# Altium schematic sheet Trigger.SchDoc
size A4; SheetNumber: 1; SheetTotal: 1
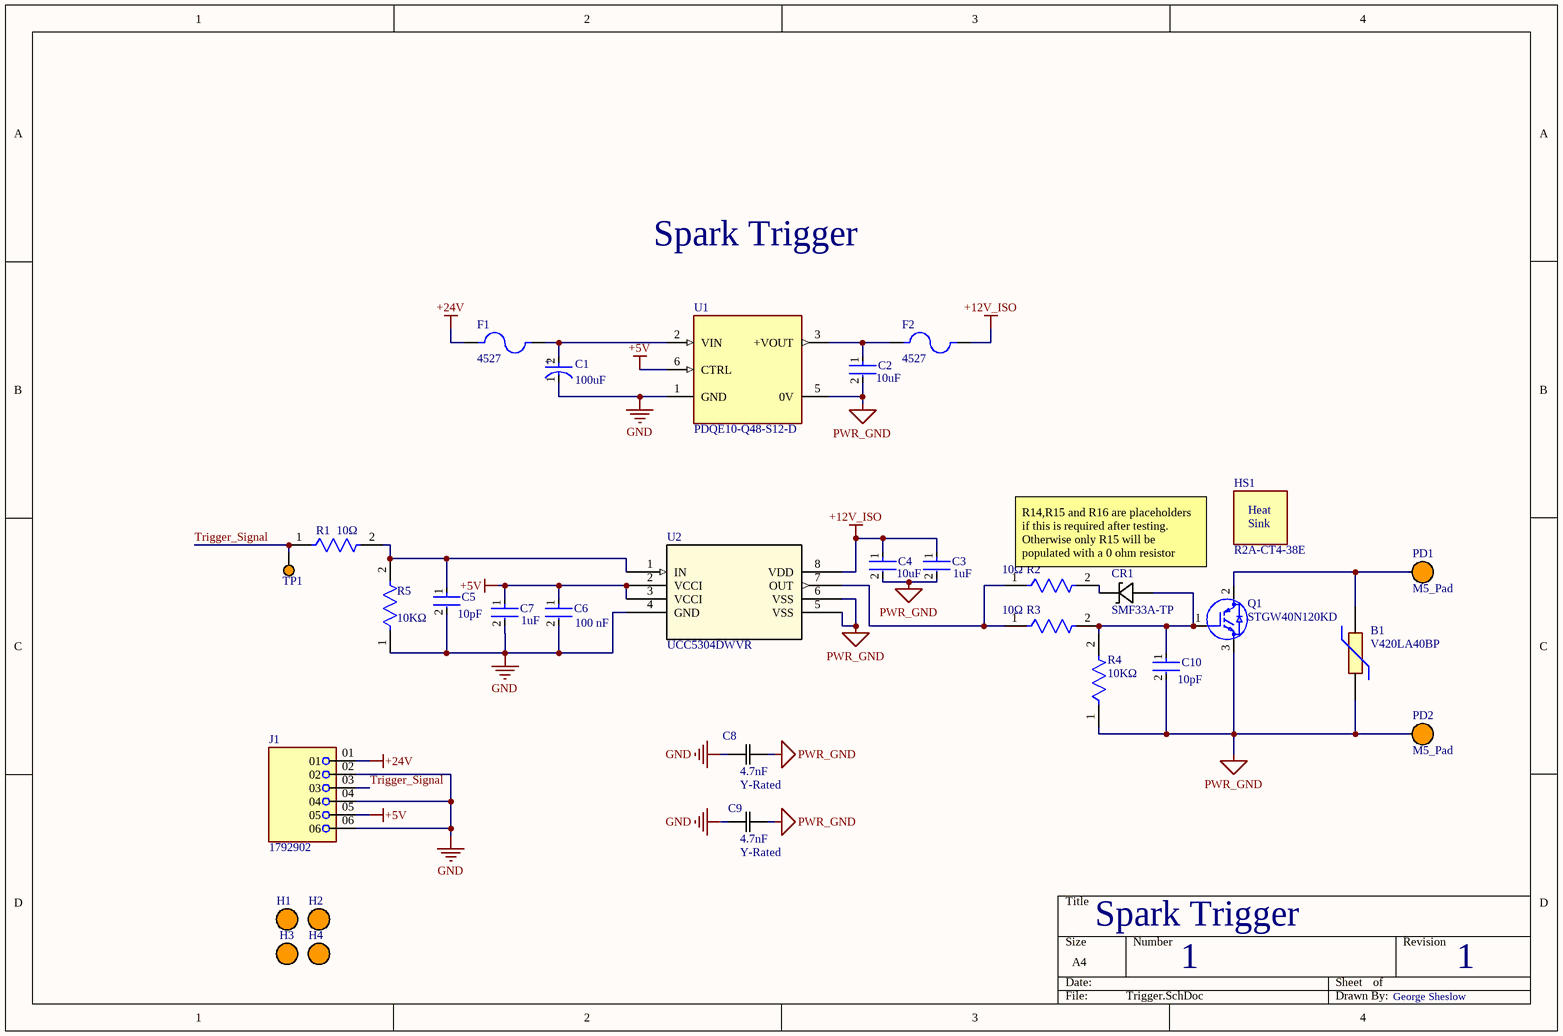
[diagram p0: Trigger.SchDoc]

## Parts
B1  V420LA40BP  [V420LA40BP]
C1  Capacitance: 100uF  [FP-RAD-TH-D_8_0_5-L_11_5-MFG]  (hidden comment: EEUFM1H101)
C2  Capacitance: 10uF  [FP-CL32-IPC_C]  (hidden comment: CL32B106KBJNNNE)
C3  value 1uF  [FP-CC1210-GA-MFG]  (hidden comment: CC1210KKX7R9BB105)
C4  Capacitance: 10uF  [FP-CL32-IPC_C]  (hidden comment: CL32B106KBJNNNE)
C5  Capacitance: 10pF  [FP-0805-L_2_01_0_2-W_1_25-MFG]  (hidden comment: 08051A100JAT2A)
C6  Capacitance: 100 nF  [FP-CC0805-0_85-MFG]  (hidden comment: CC0805KRX7R9BB104)
C7  value 1uF  [FP-CC1210-GA-MFG]  (hidden comment: CC1210KKX7R9BB105)
C8  capacitance: 4.7nF  rating: Y-Rated  [CAP_5.0 X 11.0 X 13.0_EPC]  (hidden comment: B32021A3472M189)
C9  capacitance: 4.7nF  rating: Y-Rated  [CAP_5.0 X 11.0 X 13.0_EPC]  (hidden comment: B32021A3472M189)
C10  Capacitance: 10pF  [FP-0805-L_2_01_0_2-W_1_25-MFG]  (hidden comment: 08051A100JAT2A)
CR1  SMF33A-TP  [SOD-123FL_MCC]
F1  4527  [FUSE_4527]
F2  4527  [FUSE_4527]
H1  M3_Hole  [M3_Hole]  (value not drawn)
H2  M3_Hole  [M3_Hole]  (value not drawn)
H3  M3_Hole  [M3_Hole]  (value not drawn)
H4  M3_Hole  [M3_Hole]  (value not drawn)
HS1  R2A-CT4-38E  [Heat_Sink]
J1  1792902  [PHOENIX_1792902]
PD1  M5_Pad  [M5_Pad]
PD2  M5_Pad  [M5_Pad]
Q1  STGW40N120KD  [TO545P515X1560X2445-3P]
R1  value 10Ω  [FP-RT0805-MFG]  (hidden comment: RT0805FRE0710RL)
R2  value 10Ω  [FP-RT0805-MFG]  (hidden comment: RT0805FRE0710RL)
R3  value 10Ω  [FP-RT0805-MFG]  (hidden comment: RT0805FRE0710RL)
R4  value 10KΩ  [FP-RT0805-MFG]  (hidden comment: RT0805FRE0710KL)
R5  value 10KΩ  [FP-RT0805-MFG]  (hidden comment: RT0805FRE0710KL)
TP1  Test Point  [Test_Pad]  (value not drawn)
U1  PDQE10-Q48-S12-D  [CONV_PDQE10-Q48-S12-D]
U2  UCC5304DWVR  [SOIC8_DWV_TEX]

## Nets
+5V: C6.1 C7.1 J1.05 U1.6(CTRL) U2.2(VCCI) U2.3(VCCI)
+12V_ISO: C3.1 C4.1 F2.2 U2.8(VDD)
+24V: F1.1 J1.01
GND: C1.1(C) C5.2 C6.2 C7.2 C8.1 C9.1 J1.02 J1.04 J1.06 R5.1 U1.1(GND) U2.4(GND)
PWR_GND: B1.1 C2.2 C3.2 C4.2 C8.2 C9.2 C10.2 PD2.1 Q1.3(E) R4.1 U1.5(0V) U2.5(VSS) U2.6(VSS)
Trigger_Signal: J1.03 R1.1 TP1.1(T)
NetB1_2: B1.2 PD1.1 Q1.2(C)
NetC1_2: C1.2(A) F1.2 U1.2(VIN)
NetC2_1: C2.1 F2.1 U1.3(+VOUT)
NetC5_1: C5.1 R1.2 R5.2 U2.1(IN)
NetC10_1: C10.1 CR1.2 Q1.1(G) R3.2 R4.2
NetCR1_1: CR1.1 R2.2
NetR2_1: R2.1 R3.1 U2.7(OUT)

## Notes on the sheet
- Spark Trigger
- R14,R15 and R16 are placeholders if this is required after testing.
  Otherwise only R15 will be populated with a 0 ohm resistor
- 1
- George Sheslow
- (in symbol CMP-05427-001978-1) +
- (in symbol R2A-CT4-38E) Heat; Sink

## Library data of the parts
B1 = V420LA40BP: Littelfuse LA Series Variable Resistor 600pF 100A, Clamping 1060V, Varistor 610  720V; Geometry.Height: 28mm; Mouser Part Number: 576-V420LA40BP; Mouser Price/Stock: https://www.mouser.co.uk/ProductDetail/Littelfuse/V420LA40BP?qs=%252BvNVc1OwqXLcs1GzcX8aHQ%3D%3D; Manufacturer_Name: LITTELFUSE; Manufacturer_Part_Number: V420LA40BP; Datasheet Link: https://www.littelfuse.com/~/media/electronics/datasheets/varistors/littelfuse_varistor_la_datasheet.pdf.pdf
C1 = CMP-05427-001978-1: Aluminum Electrolytic Capacitors (Radial Lead Type) 100uF ±20% 50V
C2 C4 = CMP-2000-06110-2: Cap Ceramic 10uF 50V X7R ±10% SMD 1210 +125°C Embossed T/R; Material: Ceramic; Min Operating Temperature: -55°C; Depth: 2.5mm; Radiation Hardening: No; Packaging: Tape and Reel; Dielectric: X7R; Case Code (Metric): 3225; Height: 2.5mm; Thickness: 0.106inch; Voltage Rating (DC): 50V; Voltage Rating: 50V; Width: 0.098inch; Case Code (Imperial): 1210; Length: 3.2mm; Tolerance: 10%; Lead Free: Lead Free; Package Quantity: 1; Voltage: 50V; Mount: Surface Mount; Case/Package: 1210; Max Operating Temperature: 125°C
C3 C7 = CMP-03422-000918-1: CAP CER 1UF 50V X7R 1210; Manufacturer: Yageo; Temperature Coefficient: 15%; Material: Ceramic; Tolerance: 10%; Manufacturer Part Number: CC1210KKX7R9BB105; RoHS: TRUE; Digikey Description: CAP CER 1UF 50V X7R 1210; Device Class L1: Passive Components; Temperature Range Low: -55°C; ComponentLink2Description: Datasheet; Temperature Characteristic: X7R; Capacitance: 1uF; Temperature: -55°C to +125°C; ComponentLink2URL: http://www.yageo.com/documents/recent/UPY-GPHC_X7R_6.3V-to-50V_18.pdf; Lead Free: Yes; Device Class L3: Ceramic Capacitors; Device Class L2: Capacitors; Category: Cap; Temperature Range High: +125°C; Package: CC1210-GA; Mouser Description: 1210 1 uF 50 V ±10 % Tolerance X7R SMT Multilayer Ceramic Capacitor; Octopart: https://octopart.com/cc1210kkx7r9bb105-yageo-22054290; Height: 1.45mm; Voltage Rating: 50V; Ipc Land Pattern Name: CAPC320250X125; Automotive: No; Footprint Url: http://www.yageo.com/exep/pages/download/literatures/UPY-C_GEN_24.pdf
C5 C10 = CMP-2007-04116-2: General Purpose Ceramic Capacitor, 0805, 10pF, 5%, C0G, 30ppm/°C, 100V; Dissipation Factor: 1.9%; Insulation Resistance: 100GR; Height: 0.94mm; Dielectric: C0G; Voltage Rating: 100V; REACH SVHC: No SVHC; Package Quantity: 1; Temperature Coefficient: 30ppm/°C; Mount: Surface Mount; Weight: 0.000194oz; Termination: SMD/SMT; Length: 2.01mm; Voltage: 100V; Case/Package: 0805; Width: 1.25mm; Case Code (Imperial): 0805; Case Code (Metric): 2012; Number of Pins: 2; Lead Free: Lead Free; Series: -; Min Operating Temperature: -55°C; Thickness: 0.037inch; Depth: 1.25mm; Max Operating Temperature: 125°C; Radiation Hardening: No; RoHS Compliant: Yes; Tolerance: 5%; Packaging: Tape and Reel; Voltage Rating (DC): 100V
C6 = CMP-2100-03606-3: CAP CER 0.1UF 50V X7R 0805; Manufacturer: Yageo; Tolerance: 0.1; Value: 100 nF; Material: Ceramic; Device Class L1: Passive Components; ComponentLink2Description: Datasheet; Package: CC0805-0.85; Manufacturer Part Number: CC0805KRX7R9BB104; Digikey Description: CAP CER 0.1UF 50V X7R 0805; Device Class L3: Ceramic Capacitors; Temperature: -30°C to +85°C; Temperature Characteristic: X7R; Voltage Rating: 50 V; Height: 0.95mm; RoHS: TRUE; Ipc Land Pattern Name: CAPC200125X85; Device Class L2: Capacitors; Category: Cap; Temperature Range Low: -30°C; Temperature Range High: +85°C; Mouser Description: Multilayer Ceramic Capacitors MLCC - SMD/SMT 100nF 50V X7R 10%; Footprint Url: http://www.yageo.com/exep/pages/download/literatures/UPY-C_GEN_24.pdf; Automotive: No; Octopart: https://octopart.com/cc0805krx7r9bb104-yageo-192993; Lead Free: Yes; ComponentLink2URL: http://www.yageo.com/documents/recent/UPY-GPHC_Y5V_6.3V-to-50V_8.pdf
C8 C9 = B32021A3472M189: No Description Available; Manufacturer_Name: TDK Epcos; Copyright: Copyright (C) 2025 Ultra Librarian. All rights reserved.; Manufacturer_Part_Number: B32021A3472M189
CR1 = SMF33A-TP: No Description Available; Manufacturer_Name: MCC; Copyright: Copyright (C) 2025 Ultra Librarian. All rights reserved.; Manufacturer_Part_Number: SMF33A-TP
F1 F2 = 4527: 5mm Low Profile Holder; MF: Keystone; MP: 4527; Price: None; Purchase-URL: https://pricing.snapeda.com/search/part/4527/?ref=eda; Package: None; Availability: In Stock; SnapEDA_Link: https://www.snapeda.com/parts/4527/Keystone+Electronics/view-part/?ref=snap; Value: *; Check_prices: https://www.snapeda.com/parts/4527/Keystone+Electronics/view-part/?ref=eda
HS1 = R2A-CT4-38E: Heatsink, TO-247, 8.6degC/W, 35.2 x 22 x 38mm, Spring Clip Mount | Ohmite R2A-CT4-38E; Shape: Fins,Rectangular; Finish: Anodized; Thermal Resistance @ Forced Air Flow (100 LFM): 1°C/W; Natural Thermal Resistance: 8.6°C/W; Supplier: Digikey; Supplier Part Number: R2A-CT4-38E-ND; Manufacturer: Ohmite; Manufacturer Part Number: R2A-CT4-38E; RoHS: Yes; Category: Heat Sinks; Stock: 8364; Pricing: 1=4.51, 10=3.996, 25=3.8064, 50=3.669, 100=3.5363, 480=3.25325, 960=3.13527, 1440=3.06819 (USD); Mounting Technology: Clip,PC Pin,Screw; Case/Package: TO-247; Weight: 6.4oz; Package Cooled: TO-247; Material: Aluminium; Color: Black; Package Quantity: 5; Type: Passive; Series: R2; Length: 38mm; Width: 35.2mm; Height: 22mm; Lead Free: Lead Free; RoHS Compliant: Yes; Reach SVHC Compliant: Unknown; ComponentLink1URL: https://datasheet.ciiva.com/1004/r2-series-1004312.pdf?src-supplier=Digikey; ComponentLink1Description: https://datasheet.ciiva.com/1004/r2-series-1004312.pdf?src-supplier=Digikey; ComponentLink2URL: https://datasheet.ciiva.com/39123/52r2-sink-39123818.pdf?src-supplier=Onlinecomponents.com; ComponentLink2Description: https://datasheet.ciiva.com/39123/52r2-sink-39123818.pdf?src-supplier=Onlinecomponents.com; ComponentLink3URL: https://datasheet.ciiva.com/14543/70231642-14543768.pdf?src-supplier=Allied+Electronics; ComponentLink3Description: https://datasheet.ciiva.com/14543/70231642-14543768.pdf?src-supplier=Allied+Electronics
Q1 = STGW40N120KD: STMicroelectronics STGW40N120KD IGBT, 80 A 1200 V, 3-Pin TO-247; Geometry.Height: 5.15mm; Mouser Part Number: *; Mouser Price/Stock: *; Manufacturer_Name: STMicroelectronics; Manufacturer_Part_Number: STGW40N120KD; Datasheet Link: http://www.st.com/web/en/resource/technical/document/datasheet/CD00224575.pdf
R1-R3 = CMP-03412-028725-1: RES SMD 10 OHM 1% 1/8W 0805; Manufacturer: Yageo; Tolerance: 0.0001; Temperature Coefficient: 50 ppm/°C; Voltage Rating: 150V; Power Rating: 0.125W; Package: RT0805; Lead Free: Yes; Manufacturer Part Number: RT0805FRE0710RL; Series: RT; Footprint Url: http://www.yageo.com/exep/pages/download/literatures/PYu-R_Mount_10.pdf; Temperature Range High: +155°C; Temperature Range Low: -55°C; Octopart: https://octopart.com/rt0805fre0710rl-yageo-39855890; Height: 0.6mm; Device Class L1: Passive Components; Mouser Description: High Precision-High Stability Chip Resistor Thin Film 0805 10Ohm 1% Paper T/R; ComponentLink2URL: http://www.yageo.com/documents/recent/PYu-RT_1-to-0.01_RoHS_L_9.pdf; Device Class L2: Resistors; Composition: Thin Film; Device Class L3: Chip SMD Resistors; Automotive: No; RoHS: TRUE; Ipc Land Pattern Name: RESC200125X50; Temperature: -55°C to +155°C; ComponentLink2Description: Datasheet; Resistance: 10Ω; Category: Res; Digikey Description: RES SMD 10 OHM 1% 1/8W 0805
R4 R5 = CMP-03412-023097-1: RES 10.0K OHM 1/8W 1% SMD 0805; Manufacturer: Yageo; Tolerance: 0.0001; Temperature Coefficient: 50 ppm/°C; Power Rating: 0.125W; Voltage Rating: 150V; ComponentLink2Description: Datasheet; Temperature: -55°C to +155°C; Digikey Description: RES 10.0K OHM 1/8W 1% SMD 0805; Automotive: No; Octopart: https://octopart.com/rt0805fre0710kl-yageo-40301150; Composition: Thin Film; Resistance: 10KΩ; RoHS: TRUE; Category: Res; Device Class L2: Resistors; Package: RT0805; ComponentLink2URL: http://www.yageo.com/documents/recent/PYu-RT_1-to-0.01_RoHS_L_9.pdf; Ipc Land Pattern Name: RESC200125X50; Height: 0.6mm; Footprint Url: http://www.yageo.com/exep/pages/download/literatures/PYu-R_Mount_10.pdf; Device Class L3: Chip SMD Resistors; Manufacturer Part Number: RT0805FRE0710KL; Temperature Range High: +155°C; Lead Free: Yes; Mouser Description: Thin Film Resistors 1/8W 10K ohm 1% 50ppm; Temperature Range Low: -55°C; Series: RT; Device Class L1: Passive Components
TP1 = Test Point: Just a Pad; Manufacturer: Keystone Electronics; Manufacturer Part Number: 5003; Plating: Silver; Body Material: PBT; Forward Current: 3A; Forward Voltage: 1.08V; Inside Diameter: 1.27mm; Outside Diameter: 2.54mm; Supplier: Digikey; Supplier Part Number: 36-5003-ND; RoHS: Yes; Category: Connectors; Stock: 130387; Pricing: 1=0.39, 10=0.293, 25=0.2624, 100=0.2223, 500=0.18446, 1000=0.1739, 2500=0.1542, 5000=0.14312 (USD); Mounting Technology: PCB,Through Hole; Pins: 1; Contact Material: Bronze; Contact Plating: Silver,Tin; Material: Nylon,Bronze,Silver; Color: Orange,White; Weight: 4.535924g; Package Quantity: 10; Packaging: Bulk; Series: THM; Termination: Through Hole; Length: 7.62mm; Width: 6.35mm; Height: 0.3inch; Radiation Hardening: No; Reach SVHC Compliant: No; Lead Free: Lead Free; RoHS Compliant: Yes; Flammability Rating: UL94 V-0; ComponentLink1URL: https://datasheet.ciiva.com/4598/5000-5004-4598618.pdf?src-supplier=Mouser; ComponentLink1Description: https://datasheet.ciiva.com/4598/5000-5004-4598618.pdf?src-supplier=Mouser; ComponentLink2URL: https://datasheet.ciiva.com/16885/70182825-16885788.pdf?src-supplier=Allied+Electronics; ComponentLink2Description: https://datasheet.ciiva.com/16885/70182825-16885788.pdf?src-supplier=Allied+Electronics; ComponentLink3URL: https://datasheet.ciiva.com/1454/1703983-1454826.pdf?src-supplier=Element14; ComponentLink3Description: https://datasheet.ciiva.com/1454/1703983-1454826.pdf?src-supplier=Element14; ComponentLink4URL: https://datasheet.ciiva.com/22631/1703983-22631103.pdf?src-supplier=Element14; ComponentLink4Description: https://datasheet.ciiva.com/22631/1703983-22631103.pdf?src-supplier=Element14
U1 = PDQE10-Q48-S12-D: 10 W, 4:1 Input Range, Single/Dual Regulated Output, 1500 Vdc Isolation, Dc-Dc Converter; MF: CUI Inc.; CUI_purchase_URL: https://www.cui.com/product/dc-dc-converters/isolated/pdqe10-d-series?utm_source=snapeda.com&utm_medium=referral&utm_campaign=snapedaBOM; Availability: In Stock; SnapEDA_Link: https://www.snapeda.com/parts/PDQE10-Q48-S12-D/CUI/view-part/?ref=snap; Price: None; MP: PDQE10-Q48-S12-D; Purchase-URL: https://pricing.snapeda.com/search/part/PDQE10-Q48-S12-D/?ref=eda; Check_prices: https://www.snapeda.com/parts/PDQE10-Q48-S12-D/CUI/view-part/?ref=eda; Package: DIP-6 CUI; Value: *
U2 = UCC5304DWVR: 5kVrms, 4A/6A single-channel isolated gate driver with 5V UVLO for GaNFETs & MOSFETs 8-SOIC -40 to 125; Manufacturer_Name: Texas Instruments; Copyright: Copyright (C) 2025 Ultra Librarian. All rights reserved.; Manufacturer_Part_Number: UCC5304DWVR; Datasheet: https://www.ti.com/lit/gpn/ucc5304; RefDes: RefDes; Type: Type
J1 = 1792902: Package: None; Price: None; Value: *; MP: 1792902; Availability: Unavailable